# EAGLE design OctoWatchScheme2 (EAGLE 9.5.2)
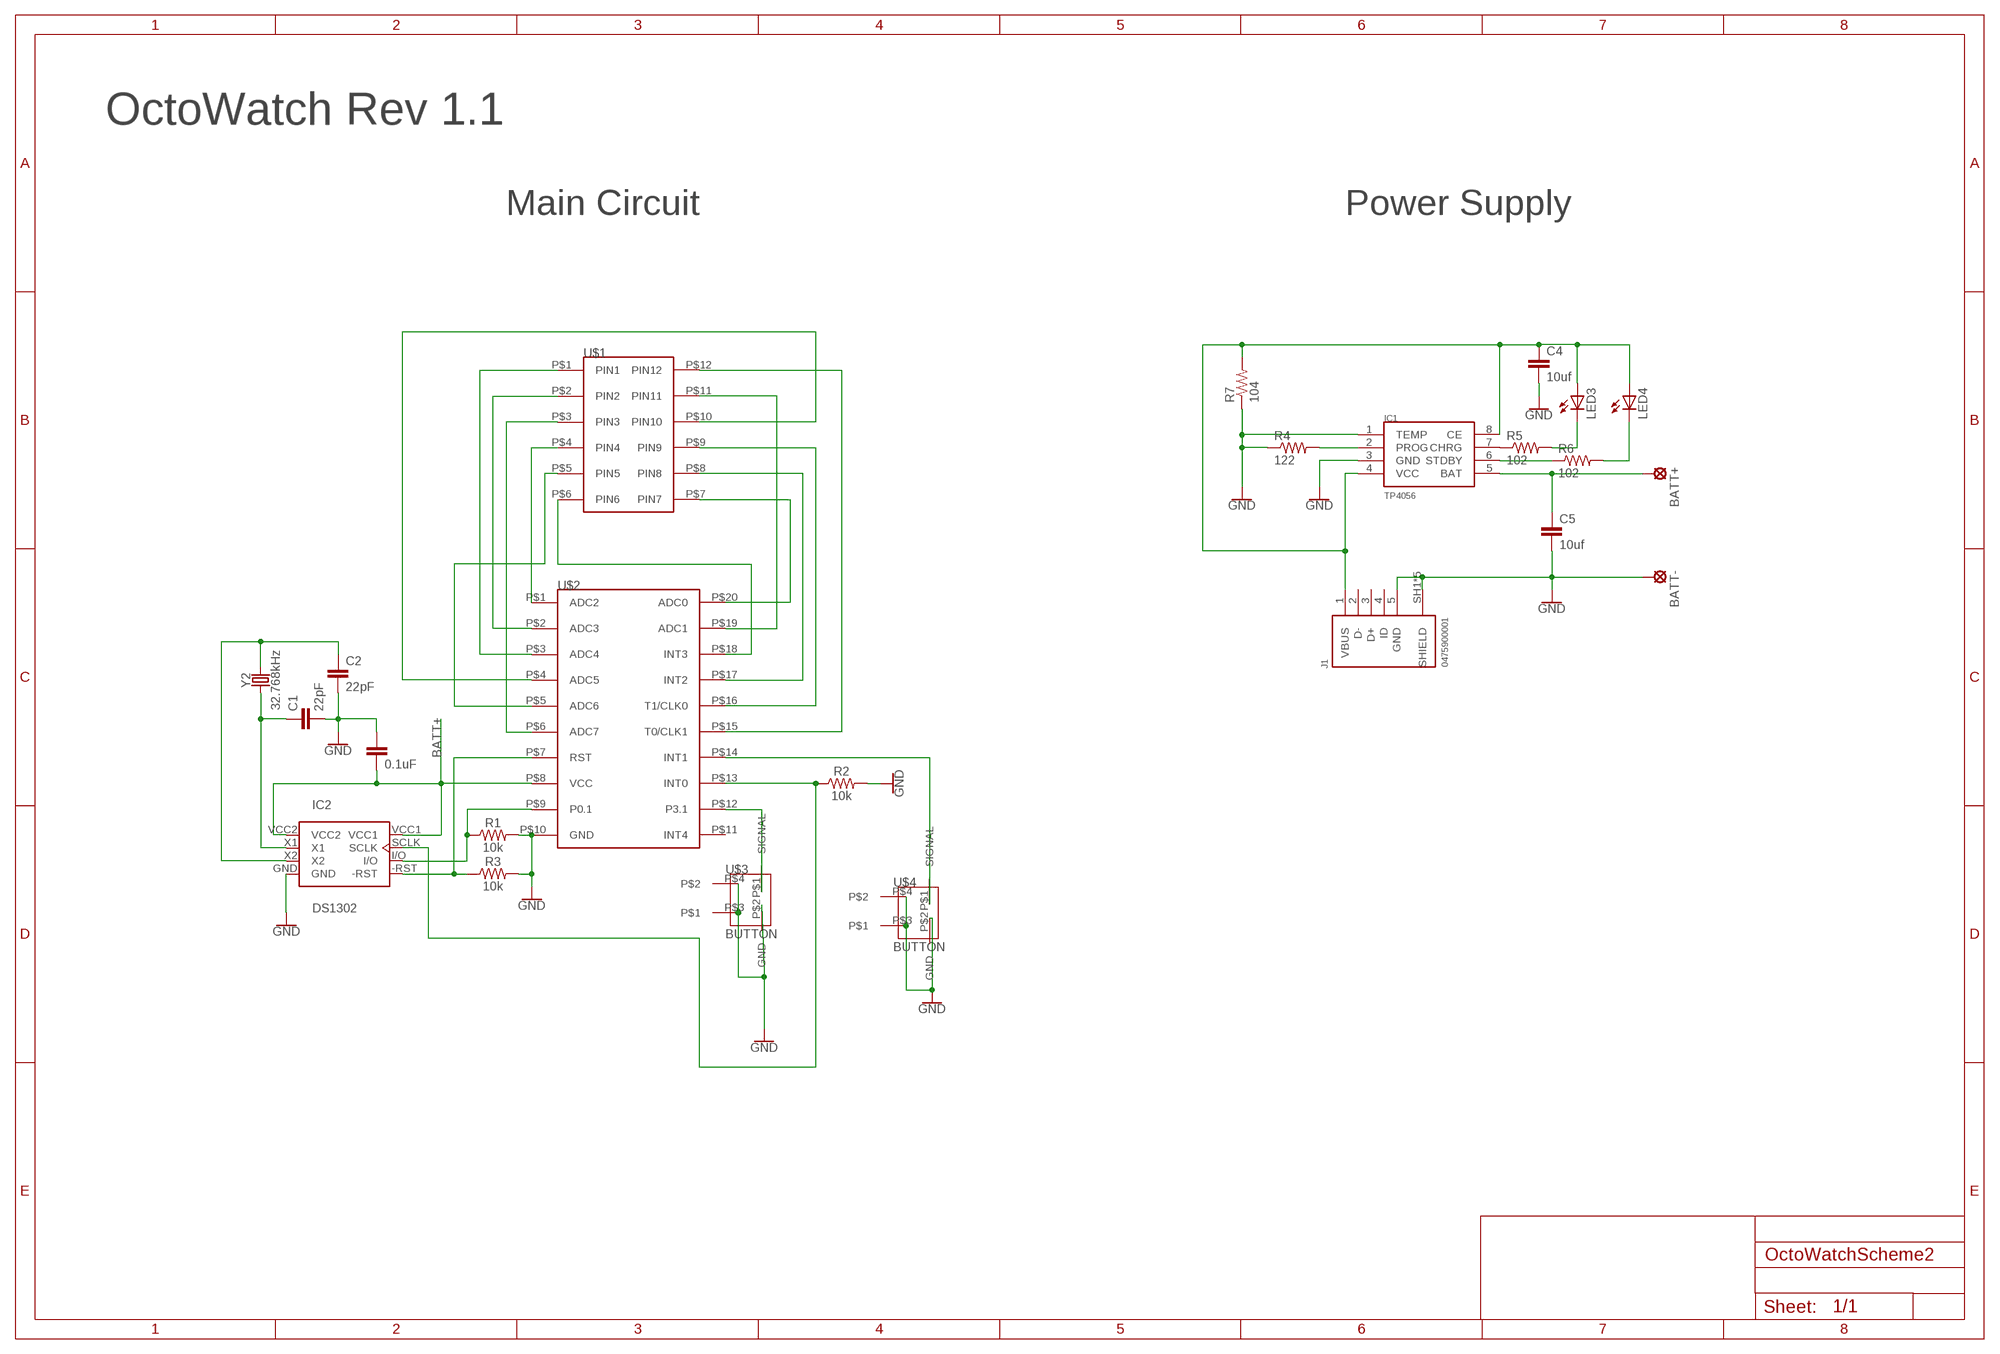
[diagram p0: schematic, sheet 1]

## Parts
BATT+  LSP13  [LSP13]
BATT-  LSP13  [LSP13]
C1  22pF  22PF-0402T-16V-10%  [0402-TIGHT]
C2  22pF  22PF-0402T-16V-10%  [0402-TIGHT]
C3  0.1uF  0.1UF-0402-6.3V-10%-X7R  [0402]
C4  10uf  C-EUC0805  [C0805]
C5  10uf  C-EUC0805  [C0805]
IC1  TP4056  [SOP-8]
IC2  DS1302  [DIL08]
J1  0475900001  [0475900001]
LED3  LEDCHIPLED_0603  [CHIPLED_0603]
LED4  LEDCHIPLED_0603  [CHIPLED_0603]
R1  10k  10KOHM-0603-1/10W-1%  [0603]
R2  10k  10KOHM-0603-1/10W-1%  [0603]
R3  10k  10KOHM-0603-1/10W-1%  [0603]
R4  122  R-US_R0402  [R0402]
R5  102  R-US_R0402  [R0402]
R6  102  R-US_R0402  [R0402]
R7  104  R-US_R0805  [R0805]
U$1  LED_SEGMENT  [LED_SEGMENT]
U$2  STC15F204AE  [STC15F204AE]
U$3  BUTTON  [BUTTON]
U$4  BUTTON  [BUTTON]
Y2  32.768kHz  CRYSTAL-32.768KHZPTH-2X6  [CRYSTAL-PTH-2X6-CYL]

## Nets
BATT+: C3.2 IC2.VCC1 IC2.VCC2 U$2.P$8(VCC)
GND: BATT-.MP C1.2 C2.2 C3.1 C4.2 C5.2 IC1.1(TEMP) IC1.3(GND) IC2.GND J1.5(GND) J1.SH1(SHIELD) J1.SH2(SHIELD) J1.SH3(SHIELD) J1.SH4(SHIELD) J1.SH5(SHIELD) R1.2 R2.2 R3.2 R4.1 R7.1 U$2.P$10(GND) U$3.P$2(GND) U$3.P$3 U$3.P$4 U$4.P$2(GND) U$4.P$3 U$4.P$4
N$1: U$1.P$1(PIN1) U$2.P$3(ADC4)
N$2: U$1.P$2(PIN2) U$2.P$2(ADC3)
N$3: U$1.P$4(PIN4) U$2.P$1(ADC2)
N$4: U$1.P$3(PIN3) U$2.P$6(ADC7)
N$5: U$1.P$5(PIN5) U$2.P$5(ADC6)
N$6: U$1.P$6(PIN6) U$2.P$18(INT3)
N$7: U$1.P$7(PIN7) U$2.P$20(ADC0)
N$8: U$1.P$8(PIN8) U$2.P$17(INT2)
N$9: U$1.P$9(PIN9) U$2.P$16(T1/CLK0)
N$10: U$1.P$10(PIN10) U$2.P$4(ADC5)
N$11: U$1.P$11(PIN11) U$2.P$19(ADC1)
N$12: U$1.P$12(PIN12) U$2.P$15(T0/CLK1)
N$13: C1.1 IC2.X1 Y2.1
N$14: IC2.-RST R3.1 U$2.P$7(RST)
N$15: C2.1 IC2.X2 Y2.2
N$17: IC2.I/O R1.1 U$2.P$9(P0.1)
N$18: BATT+.MP C5.1 IC1.5(BAT)
N$19: U$2.P$14(INT1) U$4.P$1(SIGNAL)
N$20: U$2.P$12(P3.1) U$3.P$1(SIGNAL)
N$23: IC2.SCLK R2.1 U$2.P$13(INT0)
N$26: IC1.6(STDBY) R6.1
N$27: LED4.C R6.2
N$28: IC1.7(CHRG) R5.1
N$29: LED3.C R5.2
N$31: IC1.2(PROG) R4.2
N$32: C4.1 IC1.4(VCC) IC1.8(CE) J1.1(VBUS) LED3.A LED4.A R7.2
Unconnected: J1.2(D-) J1.3(D+) J1.4(ID) U$2.P$11(INT4)

## Notes on the sheet
- OctoWatch Rev 1.1
- Main Circuit | Power Supply

## Library data of the parts
BATT+ BATT- = solpad:LSP13: SOLDER PAD drill 1.3 mm, distributor Buerklin, 12H562
C1 C2 = SparkFun-Capacitors:22PF: 22pF ceramic capacitors A capacitor is a passive two-terminal electrical component used to store electrical energy temporarily in an electric field.; PROD_ID: CAP-14674
C3 = SparkFun-Capacitors:0.1UF: 0.1µF ceramic capacitors A capacitor is a passive two-terminal electrical component used to store electrical energy temporarily in an electric field.; PROD_ID: CAP-14993
C4 C5 = rcl:C-EU: CAPACITOR, European symbol; SPICEPREFIX: C
IC1 = TP4056:TP4056
IC2 = ds1302:DS1302: Real-time clock (RTC) counts seconds, minutes hours, date of the month, month, day of the week, and year with leap-year compensation valid up to 2100
J1 = USB connector:0475900001: CONN RCPT MICRO USB AB 5P SMD RA Manufacturer's datasheet <https://www.molex.com/pdm_docs/sd/475900001_sd.pdf>; CREATED_BY: PCBLayout.com; DIGIKEY_PARTNO: WM17144TR-ND; MANUFACTURER: Molex; MPN: 0475900001
LED3 LED4 = adafruit:LED: LED OSRAM: - CHIPLED LG R971, LG N971, LY N971, LG Q971, LY Q971, LO R971, LY R971 LH N974, LH R974 LS Q976, LO Q976, LY Q976 LO Q996 - Hyper CHIPLED LW Q18S LB Q993, LB Q99A, LB R99A - SideLED LS A670, LO A670, LY A670, LG A670, LP A670 LB A673, LV A673, LT A673, LW A673 LH A674 LY A675 LS A676, LA A676, LO A676, LY A676, LW A676 LS A679, LY A679, LG A679 - Hyper Micro SIDELED® LS Y876, LA Y876, LO Y876, LY Y876 LT Y87S - SmartLED LW L88C, LW L88S LB L89C, LB L89S, LG L890 LS L89K, LO L89K, LY L89K LS L896, LA L896, LO L896, LY L896 - TOPLED LS T670, LO T670, LY T670, LG T670, LP T670 LSG T670, LSP T670, LSY T670, LOP T670, LYG T670 LG T671, LOG T671, LSG T671 LB T673, LV T673, LT T673, LW T673 LH T674 LS T676, LA T676, LO T676, LY T676, LB T676, LH T676, LSB T676, LW T676 LB T67C, LV T67C, LT T67C, LS T67K, LO T67K, LY T67K, LW E67C LS E67B, LA E67B, LO E67B, LY E67B, LB E67C, LV E67C, LT E67C LW T67C LS T679, LY T679, LG T679 LS T770, LO T770, LY T770, LG T770, LP T770 LB T773, LV T773, LT T773, LW T773 LH T774 LS E675, LA E675, LY E675, LS T675 LS T776, LA T776, LO T776, LY T776, LB T776 LHGB T686 LT T68C, LB T68C - Hyper Mini TOPLED® LB M676 - Mini TOPLED Santana® LG M470 LS M47K, LO M47K, LY M47K Source: http://www.osram.convergy.de/
R1-R3 = SparkFun-Resistors:10KOHM: 10kΩ resistor A resistor is a passive two-terminal electrical component that implements electrical resistance as a circuit element. Resistors act to reduce current flow, and, at the same time, act to lower voltage levels within circuits. - Wikipedia; PROD_ID: RES-00824
R4-R6 = rcl:R-US_: RESISTOR, American symbol; SPICEPREFIX: R
R7 = adafruit:R-US_: RESISTOR, American symbol
U$1 = OctoWatch:LED_SEGMENT: 7 segment led LCD 7mm
U$2 = OctoWatch:STC15F204AE: 15L204AE microchip for watch
U$3 U$4 = OctoWatch:BUTTON
Y2 = SparkFun-Clocks:CRYSTAL-32.768KHZ: 32.768kHz Crystal Frequency: 32.768kHz Frequency Stability: ±20ppm Load Capacitance: 12.5pF (PTH-2X6 & SMD-3.2X1.5), 6pF (SMD-2X6) SparkFun Products: SparkFun BigTime Watch Kit <https://www.sparkfun.com/products/11734> SparkFun nRF52832 Breakout <https://www.sparkfun.com/products/13990> SparkFun Real Time Clock Module <https://www.sparkfun.com/products/12708>; PROD_ID: XTAL-10112

## Board
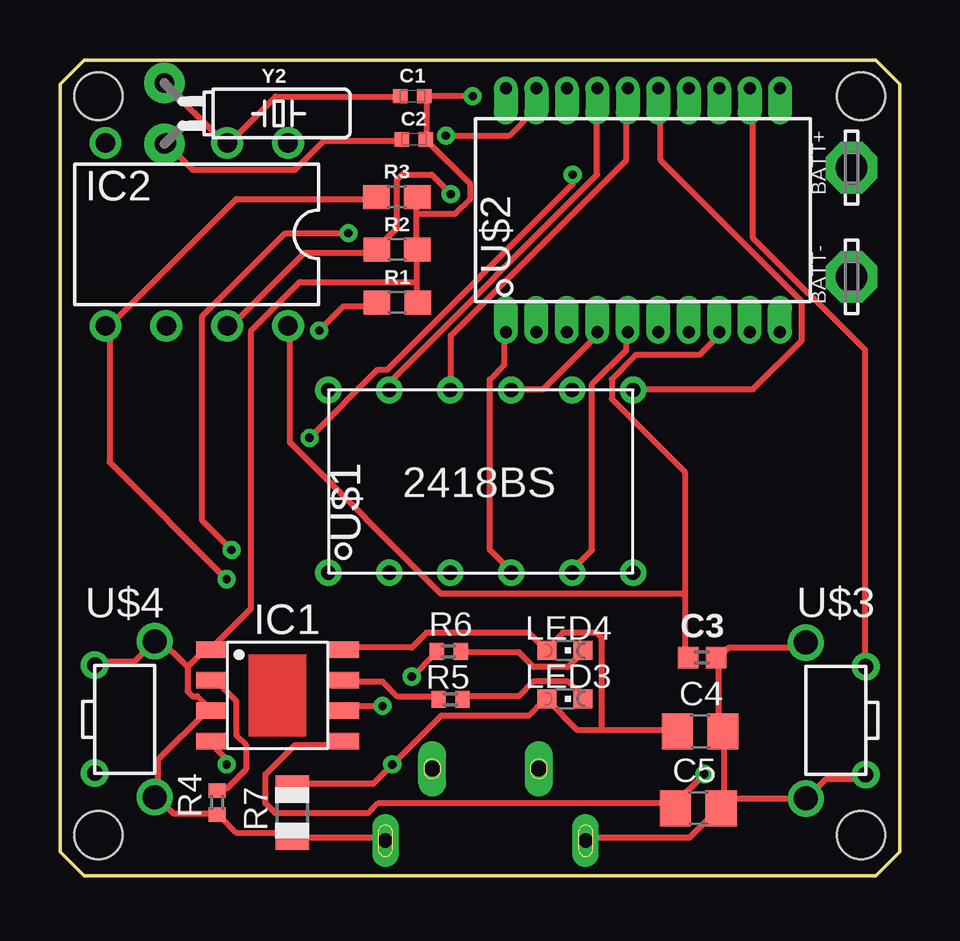
[diagram p1: board, top side]
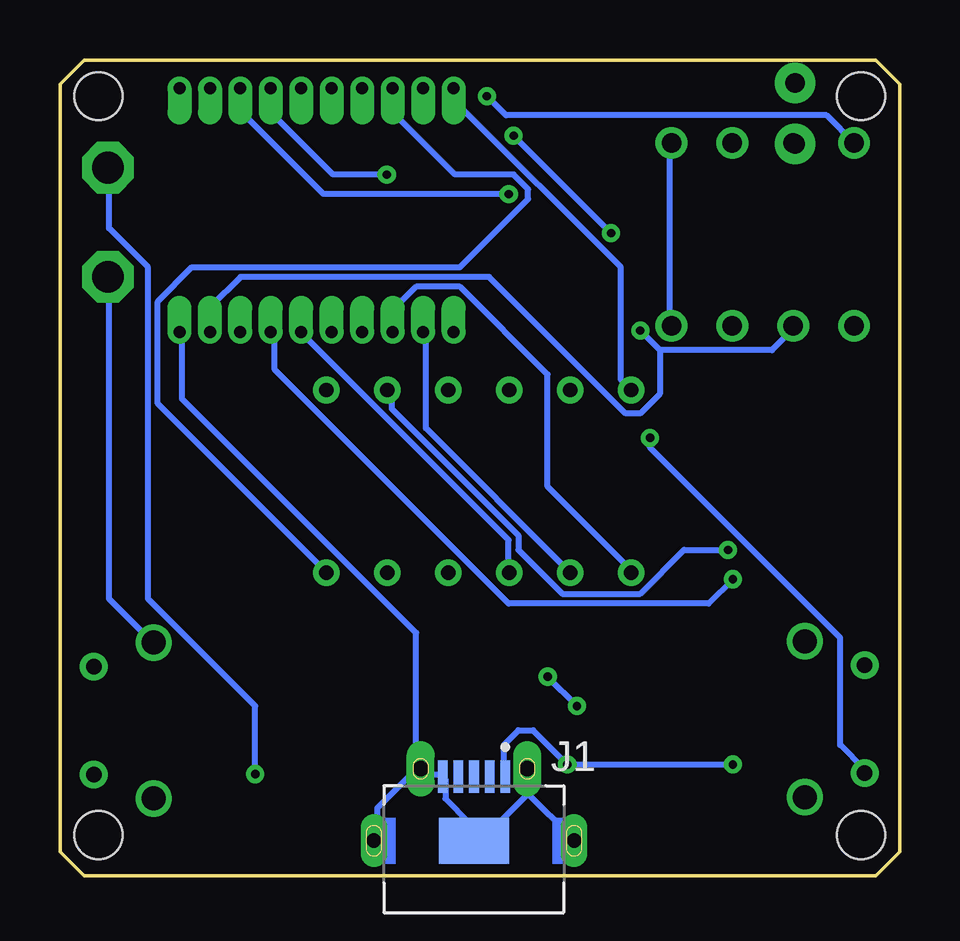
[diagram p2: board, bottom side, seen from below]

Size 35 x 34 mm. Coordinates in mm from the lower left corner, seen from the top.
Outline: 0,33 0,1 1,0 34,0 35,1 35,33 34,34 1,34 0,33
Copper layers (1*16): Top 0.035mm / dielectric 1.5mm / Bottom 0.035mm
Design rules "default *": minimum track width 10mil, minimum drill 0.35mm, track to track 6mil, track to pad 6mil, pad to pad 6mil, via to via 6mil, smd to smd 6mil, copper to edge 40mil, drill to drill 6mil, minimum pad ring 10mil, minimum via ring 8mil, stop-mask expansion 4mil, vias tented up to drill 0mil, thermal gap 10mil
Holes 2 mm at 1.6,32.49 33.4,32.49 33.4,1.69 1.6,1.69

### Footprints (pad centres in the part's own frame; a part is rotated, then mirrored left to right if it is on the bottom)
LSP13 = drill 1.321 pad 2.159 octagon: MP 0,0
0402-TIGHT = smd 0.6 x 0.6: 1 -0.5,0; 2 0.5,0
0402 = smd 0.85 x 0.9: 1 -0.58,0; 2 0.58,0
C0805 = smd 1.3 x 1.5: 1 -0.95,0; 2 0.95,0
SOP-8 = smd 1.3 x 0.7: 1 -2.75,1.905; 2 -2.75,0.635; 3 -2.75,-0.635; 4 -2.75,-1.905; 5 2.75,-1.905; 6 2.75,-0.635; 7 2.75,0.635; 8 2.75,1.905
DIL08 = drill 0.813: -RST 3.81,3.81; GND 3.81,-3.81; I/O 1.27,3.81; SCLK -1.27,3.81; VCC1 -3.81,3.81; VCC2 -3.81,-3.81; X1 -1.27,-3.81; X2 1.27,-3.81
0475900001 = smd 0.4 x 1.35: 1 1.3,2.675; 2 0.65,2.675; 3 0,2.675; 4 -0.65,2.675; 5 -1.3,2.675 | drill 0.65 pad 0.85 long: SH1 -2.225,3; SH2 2.225,3 | drill 0.6 pad 0.8 long: SH3 -4.175,0; SH4 4.175,0 | smd 2.9 x 1.9: SH5 0,0
CHIPLED_0603 = smd 0.8 x 0.8: A 0,-0.75; C 0,0.75
0603 = smd 1.1 x 1: 1 -0.85,0; 2 0.85,0
R0402 = smd 0.6 x 0.7: 1 -0.5,0; 2 0.5,0
R0805 = smd 1.1 x 1.4: 1 -1,0; 2 1,0
LED_SEGMENT = drill 0.6: P$1 -12.7,7.62; P$2 -12.7,5.08; P$3 -12.7,2.54; P$4 -12.7,0; P$5 -12.7,-2.54; P$6 -12.7,-5.08; P$7 -5.08,7.62; P$8 -5.08,5.08; P$9 -5.08,2.54; P$10 -5.08,0; P$11 -5.08,-2.54; P$12 -5.08,-5.08
STC15F204AE = drill 0.5 pad 0.813 offset: P$1 -40.64,6.35; P$2 -40.64,5.08; P$3 -40.64,3.81; P$4 -40.64,2.54; P$5 -40.64,1.27; P$6 -40.64,0; P$7 -40.64,-1.27; P$8 -40.64,-2.54; P$9 -40.64,-3.81; P$10 -40.64,-5.08; P$11 -30.48,-5.08; P$12 -30.48,-3.81; P$13 -30.48,-2.54; P$14 -30.48,-1.27; P$15 -30.48,0; P$16 -30.48,1.27; P$17 -30.48,2.54; P$18 -30.48,3.81; P$19 -30.48,5.08; P$20 -30.48,6.35
BUTTON = drill 0.65: P$1 -9,4.5; P$2 -9,0 | drill 1: P$3 -11.5,-1; P$4 -11.5,5.5
CRYSTAL-PTH-2X6-CYL = drill 0.813 pad 1.676: 1 -1.27,0; 2 1.27,0

### Placement (x,y rotation side)
BATT+  33,29.51 90 top
BATT-  33,24.96 90 top
C1  14.69,32.49 0 top
C2  14.75,30.69 0 top
C3  26.77,9.09 180 top
C4  26.69,6.01 0 top
C5  26.61,2.81 0 top
IC1  9.07,7.51 0 top
IC2  5.7,26.73 180 top
J1  17.74,1.45 0 bottom
LED3  21.05,7.37 270 top
LED4  21.05,9.38 270 top
R1  14.06,23.89 0 top
R2  14.05,26.09 0 top
R3  14.04,28.29 0 top
R4  6.55,3.05 90 top
R5  16.28,7.34 0 top
R6  16.2,9.34 0 top
R7  9.68,2.62 90 top
U$1  18.81,25.32 90 top
U$2  24.94,63.3 90 top
U$3  42.59,4.21 0 top
U$4  -7.55,8.77 180 top
Y2  4.35,31.77 270 top

### Tracks (layer width: path | path; a pad name or v marks a point on that pad's centre or on a via)
BATT+
  Top 0.254: 26.05,11.74 26.05,16.82 23,19.87 23,20.69 24.02,21.7 26.66,21.7 27.47,22.51 U$2.P$8 | 26.05,11.74 26.05,9.1 C3.2 | 26.05,11.74 15.89,11.74 9.59,18.04 9.59,22.72 IC2.VCC1
  Bottom 0.254: IC2.VCC1 9.59,22.92 9.59,30.44 IC2.VCC2
GND  (via drill 0.35)
  Top 0.254: 14.87,27.59 14.87,26.17 R2.2 14.87,25.97 14.87,24.75 | 14.87,27.59 14.87,28.2 R3.2 | 14.87,24.75 14.87,23.94 R1.2 | 14.87,27.59 16.5,27.59 17.11,28.2 17.11,28.81 15.28,30.64 C2.2 15.28,30.84 15.28,32.47 C1.2 v17.2,32.49 | 5.32,8.7 5.32,7.68 5.53,7.48 5.73,7.48 6.13,7.07 IC1.3 6.13,6.87 4.1,4.84 4.1,3.41 U$4.P$4 4.1,3.21 4.71,2.6 6.54,2.6 R4.1 6.74,2.4 7.35,1.79 9.59,1.79 R7.1 9.79,1.58 13.45,1.58 J1.SH4 | 5.32,8.7 6.13,9.51 IC1.1 6.34,9.51 7.96,11.14 7.96,22.72 9.99,24.75 14.87,24.75 | 5.32,8.7 4.1,9.92 U$4.P$3 3.9,9.71 3.09,8.9 1.46,8.9 U$4.P$2 | U$3.P$2 33.57,4.02 31.94,4.02 31.13,3.21 U$3.P$3 27.67,3.21 | 27.67,3.21 27.67,5.85 C4.2 27.47,6.05 27.47,8.9 C3.1 27.47,9.1 27.88,9.51 30.93,9.51 U$3.P$4 | 27.67,3.21 27.67,3.01 C5.2 | 27.67,3.21 C5.2 | C5.2 27.47,2.8 26.25,1.58 21.98,1.58 J1.SH3
  Bottom 0.254: BATT-.MP 32.96,24.95 32.96,11.54 31.13,9.71 U$3.P$4 | 15.48,3.41 15.48,4.43 J1.SH2 15.48,3.41 | 15.48,3.41 13.65,1.58 J1.SH4 | 15.48,3.41 17.31,1.58 17.72,1.58 J1.SH5 17.92,1.58 17.92,2.19 18.94,3.21 18.94,4.02 J1.5 19.14,4.23 19.75,4.23 19.95,4.43 J1.SH1 | U$2.P$10 29.91,22.51 29.91,19.87 20.16,10.12 20.16,4.63 J1.SH1 | J1.SH3 21.78,1.58 21.78,2.8 20.16,4.43 J1.SH1 | IC2.GND 3.04,31.69 16.4,31.69 v17.2,32.49
N$1
  Bottom 0.254: U$2.P$3 20.97,22.72 20.97,23.73 20.16,24.55 18.33,24.55 14.67,20.89 14.67,16.22 11.21,12.76 U$1.P$1
N$2
  Bottom 0.254: U$2.P$2 19.75,22.51 19.75,18.65 13.86,12.76 U$1.P$2
N$3
  Top 0.254: U$2.P$1 18.53,22.51 18.53,21.3 17.92,20.69 17.92,13.57 18.73,12.76 U$1.P$4
N$4
  Bottom 0.254: U$2.P$6 24.83,22.51 16.29,13.98 16.29,12.76 U$1.P$3
N$5
  Top 0.254: U$2.P$5 23.61,22.51 23.61,21.9 22.19,20.48 22.19,13.57 21.37,12.76 U$1.P$5
N$6
  Bottom 0.254: U$2.P$18 20.97,32.67 20.97,31.66 18.53,29.22 16.09,29.22 15.48,28.61 15.48,28.2 18.33,25.36 29.5,25.36 30.93,23.94 30.93,19.67 24.02,12.76 U$1.P$6
N$7
  Bottom 0.254: U$2.P$20 18.53,32.67 18.53,32.27 11.62,25.36 11.62,20.69 11.21,20.28 U$1.P$7
N$8
  Top 0.254: U$2.P$17 22.39,32.67 22.39,29.22 13.86,20.69 13.86,20.28 U$1.P$8
N$9
  Top 0.254: U$2.P$16 23.61,32.67 23.61,29.83 16.29,22.51 16.29,20.28 U$1.P$9
N$10
  Top 0.254: U$2.P$4 22.39,22.51 20.16,20.28 18.94,20.28 U$1.P$10
N$11  (via drill 0.35)
  Top 0.254: v16.09,30.84 18.73,30.84 19.75,31.86 19.75,32.67 U$2.P$19 | v12.03,26.78 9.39,26.78 5.93,23.33 5.93,14.79 v7.15,13.57
  Bottom 0.254: v12.03,26.78 v16.09,30.84 | v7.15,13.57 8.98,13.57 10.81,11.74 14.06,11.74 15.89,13.57 15.89,14.18 21.17,19.47 21.17,20.08 U$1.P$11
N$12
  Top 0.254: U$2.P$15 25.03,32.67 25.03,29.83 30.93,23.94 30.93,22.31 28.89,20.28 24.02,20.28 U$1.P$12
N$13
  Top 0.254: C1.1 14.06,32.47 8.98,32.47 7.15,30.64 IC2.X1 7.04,30.54 7.12,30.63 6.76,30.63 Y2.1
N$14  (via drill 0.35)
  Top 0.254: R3.1 13.04,28.2 7.35,28.2 2.07,22.92 IC2.-RST 2.07,22.72 2.07,17.23 v6.95,12.35
  Bottom 0.254: v6.95,12.35 7.96,11.34 16.29,11.34 26.05,21.09 26.05,22.51 U$2.P$7
N$15
  Top 0.254: C2.1 14.06,30.64 11.01,30.64 9.79,29.42 5.53,29.42 4.51,30.44 Y2.2 4.51,30.64 IC2.X2
N$17  (via drill 0.35)
  Top 0.254: v10.81,22.72 11.82,23.73 13.04,23.73 R1.1
  Bottom 0.254: 9.99,21.9 v10.81,22.72 | 9.99,21.9 5.32,21.9 4.51,22.72 IC2.I/O | 9.99,21.9 9.99,20.08 10.81,19.26 11.42,19.26 17.11,24.95 27.47,24.95 28.69,23.73 28.69,22.72 U$2.P$9
N$18  (via drill 0.35)
  Top 0.254: 25.64,3.01 13.25,3.01 12.84,2.6 8.98,2.6 8.57,3.01 8.57,4.23 9.79,5.45 11.62,5.45 IC1.5 | 25.64,3.01 v26.86,4.23 | 25.64,3.01 C5.1
  Bottom 0.254: v26.86,4.23 26.86,7.07 31.33,11.54 31.33,25.36 32.96,26.98 32.96,29.42 BATT+.MP
N$19  (via drill 0.35)
  Top 0.254: v21.37,29.22 21.37,28.81 13.65,21.09 13.25,21.09 v10.4,18.25
  Bottom 0.254: v21.37,29.22 23.61,29.22 26.05,31.66 26.05,32.67 U$2.P$14 | v10.4,18.25 10.4,17.84 2.48,9.92 2.48,5.45 1.46,4.43 U$4.P$1
N$20
  Top 0.254: U$2.P$12 28.89,32.67 28.89,26.58 33.57,21.9 33.57,8.9 U$3.P$1
N$23  (via drill 0.35)
  Top 0.254: IC2.SCLK 7.15,22.92 10.2,25.97 13.04,25.97 R2.1 13.25,26.17 14.06,26.98 14.06,29.02 14.26,29.22 15.48,29.22 v16.29,28.41
  Bottom 0.254: v16.29,28.41 24.02,28.41 27.47,31.86 27.47,32.67 U$2.P$13
N$26  (via drill 0.35)
  Top 0.254: v14.67,8.29 15.69,9.31 R6.1 | v13.45,7.07 11.82,7.07 IC1.6
  Bottom 0.254: v13.45,7.07 v14.67,8.29
N$27
  Top 0.254: R6.2 16.7,9.31 19.14,9.31 19.75,8.7 21.17,8.7 21.78,9.31 LED4.C
N$28
  Top 0.254: R5.1 15.69,7.48 14.06,7.48 13.45,8.09 11.82,8.09 IC1.7
N$29
  Top 0.254: R5.2 16.9,7.48 19.14,7.48 19.75,8.09 21.17,8.09 21.78,7.48 LED3.C
N$31
  Top 0.254: R4.2 6.74,3.62 6.95,3.62 7.76,4.43 7.76,5.45 7.35,5.85 7.35,7.27 6.34,8.29 IC1.2
N$32  (via drill 0.35)
  Top 0.254: v6.95,4.63 6.95,4.84 6.34,5.45 IC1.4 | 22.59,6.05 25.64,6.05 C4.1 | 22.59,6.05 21.58,6.05 20.36,7.27 LED3.A 20.16,7.27 19.55,6.66 15.89,6.66 v13.86,4.63 13.04,3.82 9.79,3.82 R7.2 | 22.59,6.05 22.59,9.92 22.39,10.12 20.97,10.12 20.36,9.51 LED4.A 20.16,9.51 19.55,10.12 15.28,10.12 14.67,9.51 11.82,9.51 IC1.8
  Bottom 0.254: v6.95,4.63 v13.86,4.63 15.28,6.05 15.89,6.05 16.5,5.45 16.5,4.23 J1.1